# Altium schematic sheet Sheet1.SchDoc
size A4
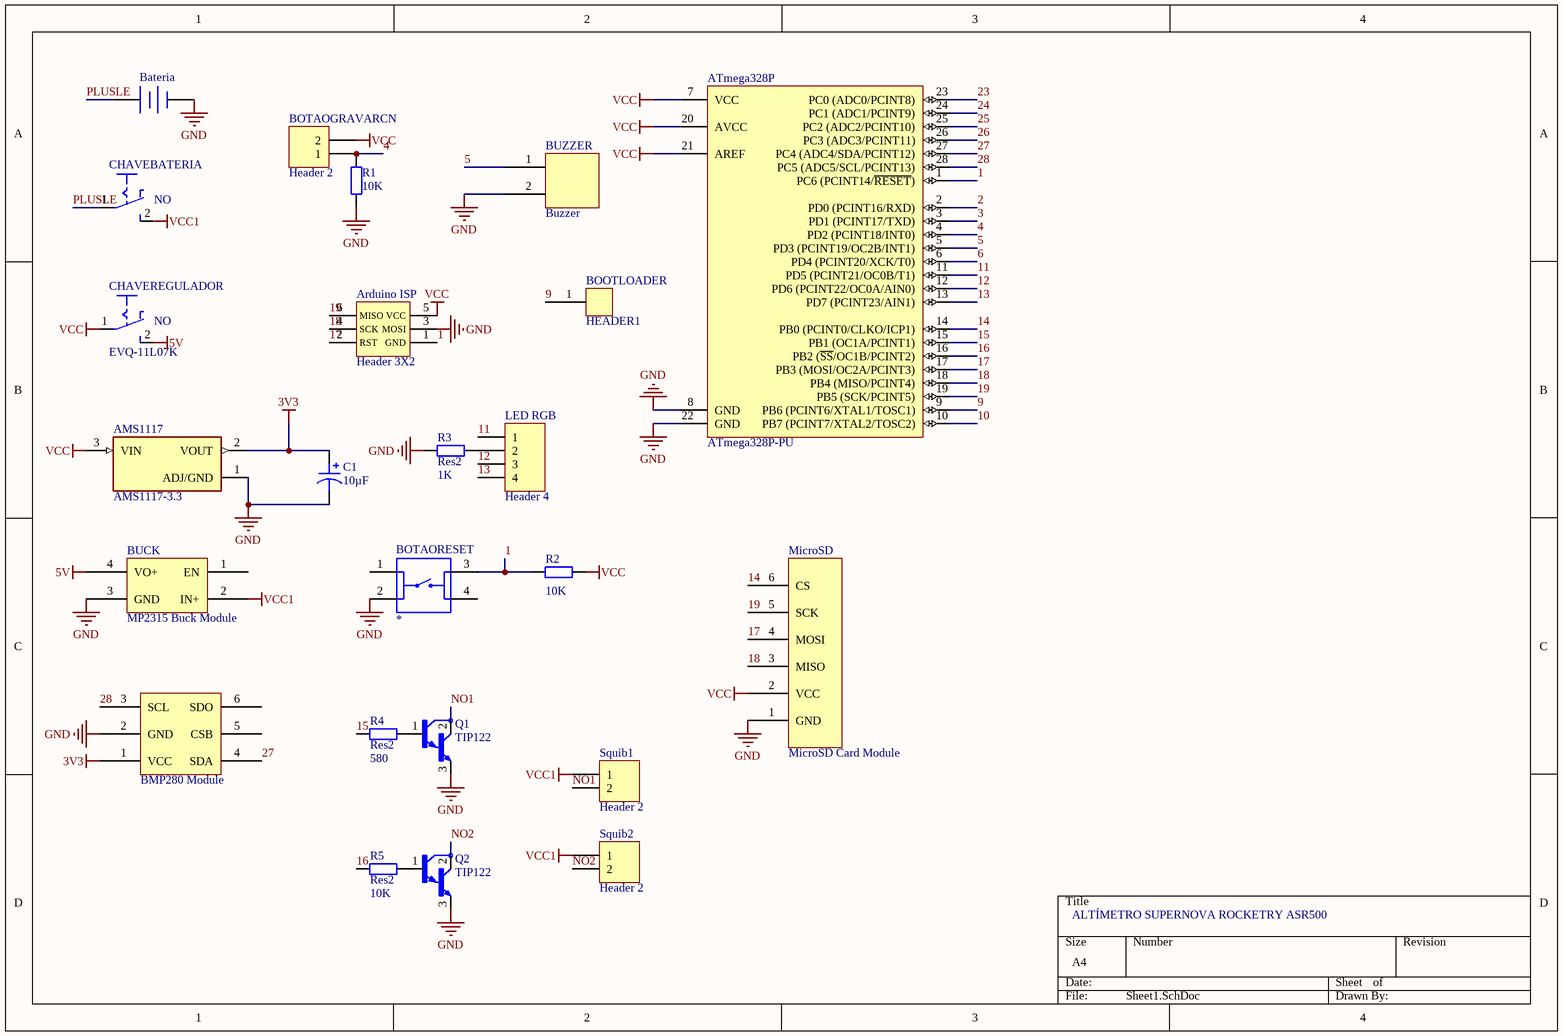
[diagram p0: Sheet1.SchDoc]

## Parts
AMS1117  AMS1117-3.3  [SOT229P700X180-4N]
Arduino_ISP  Header 3X2  [HDR2X3]
ATmega328P  ATmega328P-PU  [28P3]
Bateria  Battery  [BAT-2]  (value not drawn)
BMP280  BMP280 Module  [BMP280 Module]
BOOTLOADER  HEADER1  [HEADER1]
BOTAOGRAVARCN  Header 2  [HDR1X2]
BOTAORESET  1825910-6  [SW_1825910-6-4]  (value not drawn)
BUCK  MP2315 Buck Module  [MP2315 Buck Module]
BUZZER  Buzzer  [BUZZER]
C1  10µF  [CAP AL TH D8 L3.5 H12.5]
CHAVEBATERIA  EVQ-11L07K  [EVQ11]  (value not drawn)
CHAVEREGULADOR  EVQ-11L07K  [EVQ11]
LED_RGB  Header 4  [HDR1X4]
MicroSD  MicroSD Card Module  [MicroSD Card Module]
Q1  TIP122  [TO-220AB]
Q2  TIP122  [TO-220AB]
R1  value 10K  [AXIAL-0.4]  (hidden comment: Res2)
R2  value 10K  [AXIAL-0.4]  (hidden comment: Res2)
R3  Res2  value 1K  [AXIAL-0.4]
R4  Res2  value 580  [AXIAL-0.4]
R5  Res2  value 10K  [AXIAL-0.4]
Squib1  Header 2  [HDR1X2]
Squib2  Header 2  [HDR1X2]

## Nets
3V3: AMS1117.2(VOUT) BMP280.1(VCC) C1.1
5V: BUCK.4(VO+) CHAVEREGULADOR.2(S)
GND: AMS1117.1(ADJ/GND) Arduino_ISP.3(MOSI) ATmega328P.8(GND) ATmega328P.22(GND) Bateria.2(-) BMP280.2(GND) BOTAORESET.2 BUCK.3(GND) BUZZER.2 C1.2 MicroSD.1(GND) Q1.3(E) Q2.3(E) R1.1 R3.1
VCC: AMS1117.3(VIN) Arduino_ISP.5(VCC) ATmega328P.7(VCC) ATmega328P.20(AVCC) ATmega328P.21(AREF) BOTAOGRAVARCN.2 CHAVEREGULADOR.1(P) MicroSD.2(VCC) R2.2
VCC1: BUCK.2(IN+) CHAVEBATERIA.2(S) Squib1.1 Squib2.1
1: Arduino_ISP.1(GND) ATmega328P.1(PC6_(PCINT14/~{RESET})) BOTAORESET.3 R2.1
2: ATmega328P.2(PD0_(PCINT16/RXD))
3: ATmega328P.3(PD1_(PCINT17/TXD))
4: ATmega328P.4(PD2_(PCINT18/INT0)) BOTAOGRAVARCN.1 R1.2
5: ATmega328P.5(PD3_(PCINT19/OC2B/INT1)) BUZZER.1
6: ATmega328P.6(PD4_(PCINT20/XCK/T0))
9: ATmega328P.9(PB6_(PCINT6/XTAL1/TOSC1)) BOOTLOADER.1
10: ATmega328P.10(PB7_(PCINT7/XTAL2/TOSC2))
11: ATmega328P.11(PD5_(PCINT21/OC0B/T1)) LED_RGB.1
12: ATmega328P.12(PD6_(PCINT22/OC0A/AIN0)) LED_RGB.3
13: ATmega328P.13(PD7_(PCINT23/AIN1)) LED_RGB.4
14: ATmega328P.14(PB0_(PCINT0/CLKO/ICP1)) MicroSD.6(CS)
15: ATmega328P.15(PB1_(OC1A/PCINT1)) R4.1
16: ATmega328P.16(PB2_(~{SS}/OC1B/PCINT2)) R5.1
17: Arduino_ISP.2(RST) ATmega328P.17(PB3_(MOSI/OC2A/PCINT3)) MicroSD.4(MOSI)
18: Arduino_ISP.4(SCK) ATmega328P.18(PB4_(MISO/PCINT4)) MicroSD.3(MISO)
19: Arduino_ISP.6(MISO) ATmega328P.19(PB5_(SCK/PCINT5)) MicroSD.5(SCK)
23: ATmega328P.23(PC0_(ADC0/PCINT8))
24: ATmega328P.24(PC1_(ADC1/PCINT9))
25: ATmega328P.25(PC2_(ADC2/PCINT10))
26: ATmega328P.26(PC3_(ADC3/PCINT11))
27: ATmega328P.27(PC4_(ADC4/SDA/PCINT12)) BMP280.4(SDA)
28: ATmega328P.28(PC5_(ADC5/SCL/PCINT13)) BMP280.3(SCL)
NO1: Q1.2(C) Squib1.2
NO2: Q2.2(C) Squib2.2
PLUSLE: Bateria.1(+) CHAVEBATERIA.1(P)
NetLED_RGB_2: LED_RGB.2 R3.2
NetQ1_1: Q1.1(B) R4.2
NetQ2_1: Q2.1(B) R5.2

Not connected (* = marked no-connect by the designer): BMP280 5(CSB) 6(SDO); BOTAORESET 1 4; BUCK 1(EN)

## Notes on the sheet
- ALTÍMETRO SUPERNOVA ROCKETRY ASR500
- (in symbol EVQ-11L07K) NO

## Library data of the parts
AMS1117 = AMS1117-3.3: Sot223/Pkg 1-Amp 3.3-Volt Low Drop Out Voltage Regulatator; MF: Advanced Monolithic Systems; Price: None; Package: None; Value: *; MP: AMS1117-3.3; Availability: Unavailable; SnapEDA_Link: https://www.snapeda.com/parts/AMS1117-3.3/Advanced%20Monolithic%20Systems/view-part/53450/?ref=snap
Arduino_ISP = Header 3X2: Header, 3-Pin, Dual row; LatestRevisionDate: 17-Jul-2002; LatestRevisionNote: Re-released for DXP Platform.; Publisher: Altium Limited
ATmega328P = ATmega328P-PU: 8-bit AVR Microcontroller, 32KB Flash, 1KB EEPROM, 2KB SRAM, 28-pin PDIP, Industrial Grade (-40°C to 85°C); Published: 1-Apr-2010; DatasheetVersion: revA, Jan-2010; PackageVersion: revB, Sep-2001; PackageReference: 28P3; Publisher: Altium Limited; PackageDescription: 28-lead (0.300"/7.62mm Wide) Plastic Dual Inline Package (PDIP); Supplier 1: Digi-Key; Supplier Part Number 1: ATMEGA328P-PU-ND; Supplier 2: Farnell; Supplier Part Number 2: 1715487; Supplier 3: Mouser; Supplier Part Number 3: 556-ATMEGA328P-PU; ComponentLink1Description: Manufacturer Link; ComponentLink1URL: http://www.atmel.com/products/avr/default.asp?; ComponentLink2Description: ATmega48A/48PA/88A/88PA/168A/168PA/328/328P Datasheet; ComponentLink2URL: http://www.atmel.com/dyn/resources/prod_documents/8271.pdf; ComponentLink3Description: ATmega48A/48PA/88A/88PA/168A/168PA/328/328P Summary; ComponentLink3URL: http://www.atmel.com/dyn/resources/prod_documents/8271S.pdf; ComponentLink4Description: Atmel.com Home; ComponentLink4URL: http://www.atmel.com
Bateria = Battery: Multicell Battery; Published: 24-Mar-1999; LatestRevisionDate: 17-Jul-2002; LatestRevisionNote: Re-released for DXP Platform.; PackageReference: BAT-2; Publisher: Altium Limited; PackageDescription: Battery; 2 Leads
BMP280 = BMP280 Module: BMP280 Module REF. 9SS08
BOTAOGRAVARCN Squib1 Squib2 = Header 2: Header, 2-Pin; LatestRevisionDate: 17-Jul-2002; LatestRevisionNote: Re-released for DXP Platform.; Publisher: Altium Limited
BOTAORESET = 1825910-6: Switch Push Button OFF _ON_ SPST Round Button 0.05A 24VDC Momentary Contact PC Pins Thru-Hole; Configuration_Pole-Throw: Single Pole - Single Throw; MF: TE Connectivity; Contact_Current_Rating: 50 mA; Digi-Key_Purchase_URL: https://www.digikey.com/product-detail/en/te-connectivity-alcoswitch-switches/1825910-6/450-1650-ND/1632536?utm_source=snapeda&utm_medium=aggregator&utm_campaign=symbol; TE_purchase_URL: https://www.te.com/usa-en/product-1825910-6.html?te_bu=Cor&te_type=disp&te_campaign=seda_glo_cor-seda-global-disp-prtnr-fy19-seda-model-bom-cta_sma-317_1&elqCampaignId=32493; Value: *; Digi-Key_Part_Number: 450-1650-ND; SnapEDA_Link: https://www.snapeda.com/parts/1825910-6/TE%20Connectivity%20ALCOSWITCH%20Switches/view-part/424522/?ref=snap; EU_RoHS_Compliance: Compliant; MP: 1825910-6; Package: None; Comment_1: *
C1 = UKL2A100MPD1TD: CAP ALUM 10UF 20% 100V RADIAL; Manufacturer: Nichicon; Lifetime @ Temp.: 2000 Hrs @ 85°C; Polarization: Polar; Ripple Current @ High Frequency: 180mA @ 10kHz; Ripple Current @ Low Frequency: 90mA @ 120Hz; Part Number: UKL2A100MPD1TD; Applications: General Purpose; Capacitance: 10µF; ComponentLink1Description: Datasheet; ComponentLink1URL: http://nichicon-us.com/english/products/pdfs/e-ukl.pdf; ComponentLink2Description: DigiKey Link; ComponentLink2URL: http://digikey.com/product-detail/en/nichicon/UKL2A100MPD1TD/493-10590-1-ND/4317611; Device Package: Radial, Can; Height - Seated (Max): 0.492" (12.50mm); LastUpdated: 21/01/2020 03:40:57; Lead Spacing: 0.138" (3.50mm); Lifecycle Status: Active; Minimum Order: 1; Mounting Type: Through Hole; Operating Temperature: -40°C ~ 85°C; Package / Case: Radial, Can; Packaging: TapeAndBox; PartId: 7259; Part Status: Active; Price: 0.13; Series: UKL; Size / Dimension: 0.315" Dia (8.00mm); Supplier 1: DigiKey; Supplier Part Number 1: 493-10590-1-ND; Tolerance: ±20%; Value: 10µF; Voltage - Rated: 100V
CHAVEBATERIA CHAVEREGULADOR = EVQ-11L07K: Tactile Switch SPST-NO Top Actuated Through Hole; MF: Panasonic; Price: None; SnapEDA_Link: https://www.snapeda.com/parts/EVQ-11L07K/Panasonic%20Electronic%20Components/view-part/310716/?ref=snap; MP: EVQ-11L07K; Availability: Unavailable; Value: *; Package: None
LED_RGB = Header 4: Header, 4-Pin; LatestRevisionDate: 17-Jul-2002; LatestRevisionNote: Re-released for DXP Platform.; Publisher: Altium Limited
MicroSD = MicroSD Card Module: MicroSD Card Module REF. 4MD36
Q1 Q2 = TIP122: Trans Darlington NPN 100V 5A 2000mW Automotive 3-Pin(3+Tab) TO-220 Bag; MF: NTE Electronics, Inc; Availability: Unavailable; Package: None; DigiKey-Purchase-URL: https://snapeda.com/shop?store=DigiKey&id=4804824; MP: TIP122; Mouser-Purchase-URL: https://snapeda.com/shop?store=Mouser&id=4804824; Value: *; SnapEDA_Link: https://www.snapeda.com/parts/TIP122/NTE%20Electronics/view-part/4804824/?ref=snap; Price: None
R1-R5 = Res2: Resistor; Published: 8-Jun-2000; LatestRevisionDate: 17-Jul-2002; LatestRevisionNote: Re-released for DXP Platform.; PackageReference: AXIAL-0.4; Publisher: Altium Limited; PackageDescription: Axial Device, Thru-Hole; 2 Leads; 0.4 in Pin Spacing